# Altium schematic sheet 3d_dsn_approx.SchDoc
size A1; SheetNumber: 1; SheetTotal: 3
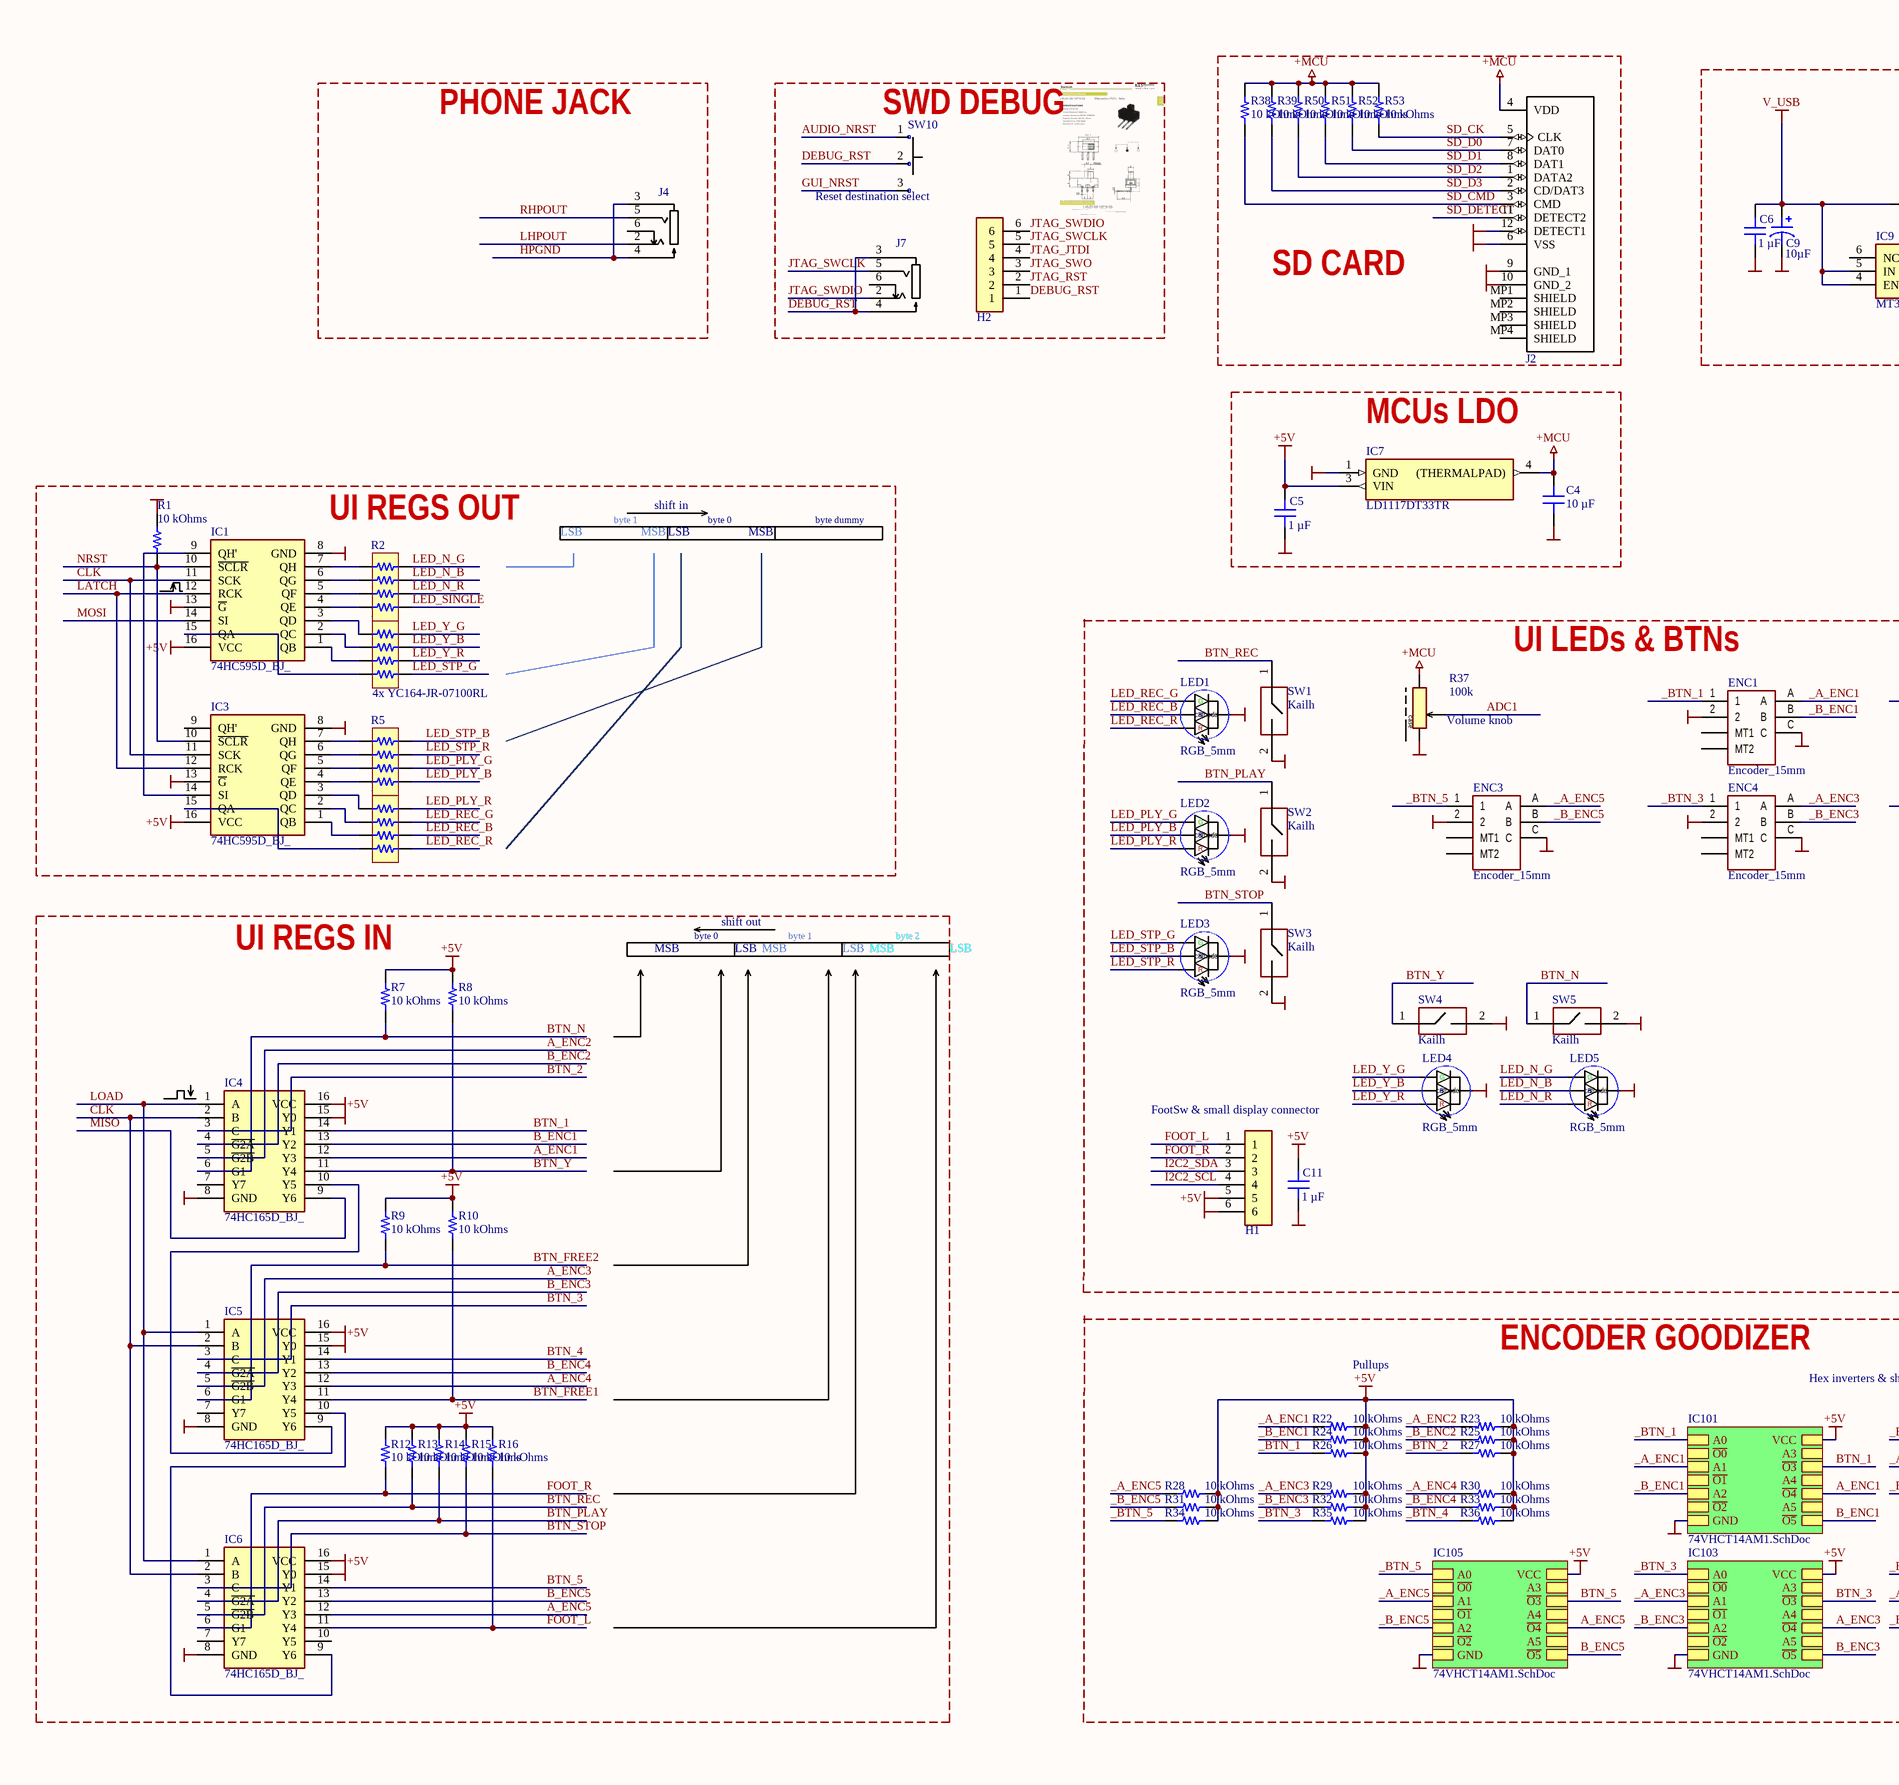
[diagram p0: 3d_dsn_approx.SchDoc, left]
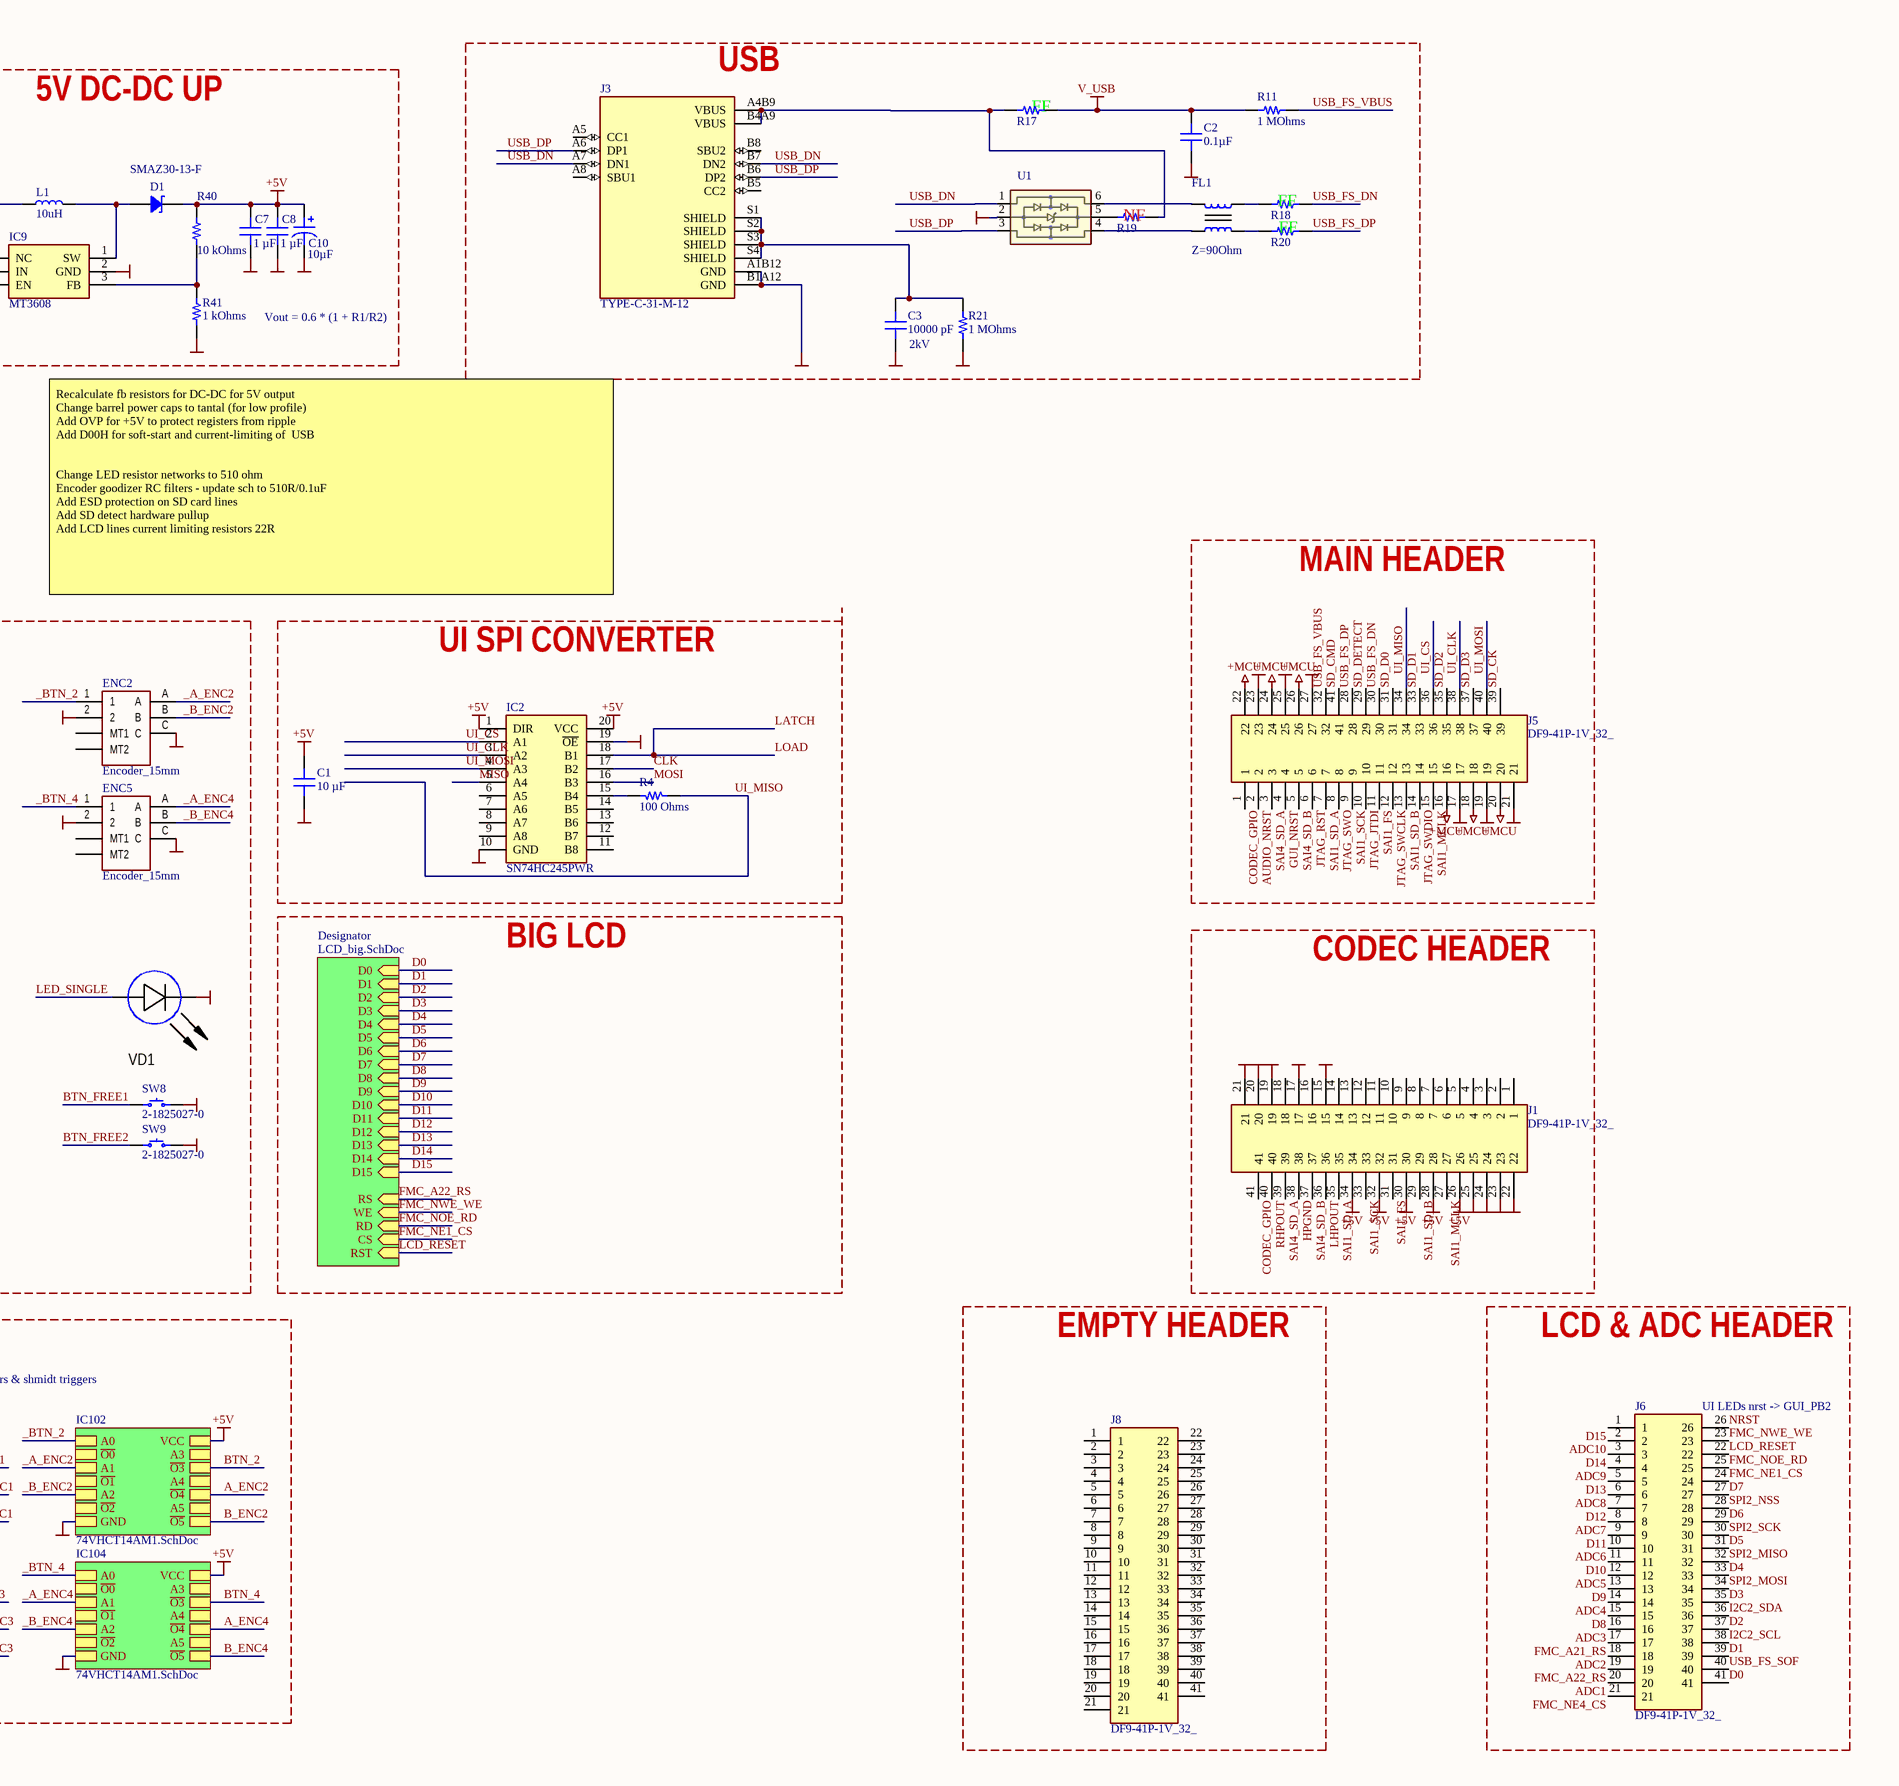
[diagram p1: 3d_dsn_approx.SchDoc, right]

## Parts
C1  10 µF  [CAP 0805_2012]
C2  0.1µF  [CAP 0402_1005]
C3  10000 pF  [CAP 1210_3225 - 1MM]
C4  10 µF  [CAP 0805_2012]
C5  1 µF  [CAP 0805_2012]
C6  1 µF  [CAP 0805_2012]
C7  1 µF  [CAP 0805_2012]
C8  1 µF  [CAP 0805_2012]
C9  10µF  [CAP ALSMD POLY 4.3MM H5.5MM]
C10  10µF  [CAP ALSMD POLY 4.3MM H5.5MM]
C11  1 µF  [CAP 0805_2012]
D1  SMAZ30-13-F  [DO214AC SMA]
ENC1  Encoder_15mm  [EC11_15mm]
ENC2  Encoder_15mm  [EC11_15mm]
ENC3  Encoder_15mm  [EC11_15mm]
ENC4  Encoder_15mm  [EC11_15mm]
ENC5  Encoder_15mm  [EC11_15mm]
FL1  Z=90Ohm  [FIL_ACM2012-361-2P-T002]
H1  1.5-6A  [1.5-6A]  (value not drawn)
H2  1.5-6A  [1.5-6A]  (value not drawn)
IC1  74HC595D_BJ_  [SOIC127P600X175-16N]
IC2  SN74HC245PWR  [SOP65P640X120-20N]
IC3  74HC595D_BJ_  [SOIC127P600X175-16N]
IC4  74HC165D_BJ_  [SOIC127P600X175-16N]
IC5  74HC165D_BJ_  [SOIC127P600X175-16N]
IC6  74HC165D_BJ_  [SOIC127P600X175-16N]
IC7  LD1117DT33TR  [TO228P972X240-3N]
IC9  MT3608  [SOT95P280X145-6N]
J1  DF9-41P-1V_32_  [HIROSE_DF9-41P-1V(32)]
J2  SCHA4B0400  [SCHA4B0400]  (value not drawn)
J3  TYPE-C-31-M-12  [HRO_TYPE-C-31-M-12 - REZONIT]
J4  35RASMT2BHNTRX  [PJ_327]  (value not drawn)
J5  DF9-41P-1V_32_  [HIROSE_DF9-41P-1V(32)]
J6  DF9-41P-1V_32_  [HIROSE_DF9-41P-1V(32)]
J7  35RASMT2BHNTRX  [PJ_327]  (value not drawn)
J8  DF9-41P-1V_32_  [HIROSE_DF9-41P-1V(32)]
L1  10uH  [IND_CD54]
LED1  RGB_5mm  [LED_RGB_5MM]
LED2  RGB_5mm  [LED_RGB_5MM]
LED3  RGB_5mm  [LED_RGB_5MM]
LED4  RGB_5mm  [LED_RGB_5MM]
LED5  RGB_5mm  [LED_RGB_5MM]
R1  10 kOhms  [RES 0603_1608]
R2  YC164-JR-07100RL  [RESNET 1206-8 CONVEX]  (value not drawn)
R3  YC164-JR-07100RL  [RESNET 1206-8 CONVEX]  (value not drawn)
R4  100 Ohms  [RES 0402_1005]
R5  YC164-JR-07100RL  [RESNET 1206-8 CONVEX]  (value not drawn)
R6  YC164-JR-07100RL  [RESNET 1206-8 CONVEX]  (value not drawn)
R7  10 kOhms  [RES 0603_1608]
R8  10 kOhms  [RES 0603_1608]
R9  10 kOhms  [RES 0603_1608]
R10  10 kOhms  [RES 0603_1608]
R11  1 MOhms  [RES 0603_1608]
R12  10 kOhms  [RES 0603_1608]
R13  10 kOhms  [RES 0603_1608]
R14  10 kOhms  [RES 0603_1608]
R15  10 kOhms  [RES 0603_1608]
R16  10 kOhms  [RES 0603_1608]
R17  (no value)  [RES 0603_1608]
R18  (no value)  [RES 0603_1608]
R19  (no value)  [RES 0603_1608]
R20  (no value)  [RES 0603_1608]
R21  1 MOhms  [RES 0603_1608]
R22  10 kOhms  [RES 0603_1608]
R23  10 kOhms  [RES 0603_1608]
R24  10 kOhms  [RES 0603_1608]
R25  10 kOhms  [RES 0603_1608]
R26  10 kOhms  [RES 0603_1608]
R27  10 kOhms  [RES 0603_1608]
R28  10 kOhms  [RES 0603_1608]
R29  10 kOhms  [RES 0603_1608]
R30  10 kOhms  [RES 0603_1608]
R31  10 kOhms  [RES 0603_1608]
R32  10 kOhms  [RES 0603_1608]
R33  10 kOhms  [RES 0603_1608]
R34  10 kOhms  [RES 0603_1608]
R35  10 kOhms  [RES 0603_1608]
R36  10 kOhms  [RES 0603_1608]
R37  100k  [POT]
R38  10 kOhms  [RES 0603_1608]
R39  10 kOhms  [RES 0603_1608]
R40  10 kOhms  [RES 0603_1608]
R41  1 kOhms  [RES 0603_1608]
R50  10 kOhms  [RES 0603_1608]
R51  10 kOhms  [RES 0603_1608]
R52  10 kOhms  [RES 0603_1608]
R53  10 kOhms  [RES 0603_1608]
SW1  Kailh  [Kailh_Low]
SW2  Kailh  [Kailh_Low]
SW3  Kailh  [Kailh_Low]
SW4  Kailh  [Kailh_Low]
SW5  Kailh  [Kailh_Low]
SW8  2-1825027-0  [TE 2-1825027-0]
SW9  2-1825027-0  [TE 2-1825027-0]
SW10  Reset destination select  [SLIDE_SW_BIG]
U1  (no value)  [SOT-666]
VD1  (no value)  [LED: 0805R]

## Blocks framed on the sheet
SD CARD: J2 R38 R39 R50-R53
5V DC-DC UP: C6-C10 D1 IC9 L1 R40 R41
USB: C2 C3 FL1 J3 R11 R17-R21 U1
PHONE JACK: J4
SWD DEBUG: H2 J7 SW10
MCUs LDO: C4 C5 IC7
UI REGS OUT: IC1 IC3 R1-R3 R5 R6
MAIN HEADER: J5
UI LEDs & BTNs: C11 ENC1-ENC5 H1 LED1-LED5 R37 SW1-SW5 SW8 SW9 VD1
UI REGS IN: IC4-IC6 R7-R10 R12-R16
CODEC HEADER: J1
ENCODER GOODIZER: R22-R36
EMPTY HEADER: J8
LCD & ADC HEADER: J6

## Sub-sheets
Designator = LCD_big.SchDoc: D8 (in), D6 (in), D0 (in), D14 (in), D2 (in), D11 (in), D9 (in), D13 (in), D3 (in), D1 (in), D4 (in), D15 (in), D10 (in), D5 (in), D7 (in), D12 (in), RS (in), RST (in), WE (in), RD (in), CS (in)
IC101 = 74VHCT14AM1.SchDoc: A0, ~{O0}, A1, ~{O1}, A2, ~{O2}, GND, VCC, A3, ~{O3}, A4, ~{O4}, A5, ~{O5}
IC102 = 74VHCT14AM1.SchDoc: A0, ~{O0}, A1, ~{O1}, A2, ~{O2}, GND, VCC, A3, ~{O3}, A4, ~{O4}, A5, ~{O5}
IC103 = 74VHCT14AM1.SchDoc: A0, ~{O0}, A1, ~{O1}, A2, ~{O2}, GND, VCC, A3, ~{O3}, A4, ~{O4}, A5, ~{O5}
IC104 = 74VHCT14AM1.SchDoc: A0, ~{O0}, A1, ~{O1}, A2, ~{O2}, GND, VCC, A3, ~{O3}, A4, ~{O4}, A5, ~{O5}
IC105 = 74VHCT14AM1.SchDoc: A0, ~{O0}, A1, ~{O1}, A2, ~{O2}, GND, VCC, A3, ~{O3}, A4, ~{O4}, A5, ~{O5}

## Nets
+5V: C1.2 C5.2 C7.2 C8.2 C10.1 C11.2 D1.2 H1.5 IC1.16(VCC) IC2.1(DIR) IC2.20(VCC) IC3.16(VCC) IC4.16(VCC) IC5.16(VCC) IC6.16(VCC) IC7.3(VIN) J1.26 J1.28 J1.30 J1.32 J1.34 R7.2 R8.2 R9.2 R10.2 R12.2 R13.2 R14.2 R15.2 R16.2 R22.2 R23.2 R24.2 R25.2 R26.2 R27.2 R28.2 R29.2 R30.2 R31.2 R32.2 R33.2 R34.2 R35.2 R36.2 R40.2 ; sheet IC101/VCC, sheet IC102/VCC, sheet IC103/VCC, sheet IC104/VCC, sheet IC105/VCC
+MCU: C4.2 IC7.4((THERMALPAD)) J2.4(VDD) J5.16 J5.18 J5.20 J5.22 J5.24 J5.26 R37.1 R38.2 R39.2 R50.2 R51.2 R52.2 R53.2
GND: C1.1 C2.1 C3.1 C4.1 C5.1 C6.1 C7.1 C8.1 C9.2 C10.2 C11.1 ENC1.2 ENC1.C ENC2.2 ENC2.C ENC3.2 ENC3.C ENC4.2 ENC4.C ENC5.2 ENC5.C H1.6 IC1.8(GND) IC1.13(~{G}) IC2.10(GND) IC2.19(~{OE}) IC3.8(GND) IC3.13(~{G}) IC4.8(GND) IC4.15(Y0) IC5.8(GND) IC5.15(Y0) IC6.8(GND) IC6.15(Y0) IC7.1(GND) IC9.2(GND) J1.15 J1.17 J1.19 J1.20 J1.21 J1.22 J1.23 J1.24 J1.25 J2.6(VSS) J2.9(GND_1) J2.10(GND_2) J2.12(DETECT1) J3.A1B12(GND) J3.B1A12(GND) J5.17 J5.19 J5.21 J5.23 J5.25 J5.27 LED1.3(cathode) LED2.3(cathode) LED3.3(cathode) LED4.3(cathode) LED5.3(cathode) R1.2 R21.1 R37.3 R41.1 SW1.2 SW2.2 SW3.2 SW4.2 SW5.2 SW8.2 SW9.2 U1.2 VD1.2(C) ; sheet IC101/GND, sheet IC102/GND, sheet IC103/GND, sheet IC104/GND, sheet IC105/GND
V_USB: C2.2 C6.2 C9.1 IC9.4(EN) IC9.5(IN) L1.2 R11.2 R17.1
_A_ENC1: ENC1.A R22.1 ; sheet IC101/A1
_A_ENC2: ENC2.A R23.1 ; sheet IC102/A1
_A_ENC3: ENC4.A R29.1 ; sheet IC103/A1
_A_ENC4: ENC5.A R30.1 ; sheet IC104/A1
_A_ENC5: ENC3.A R28.1 ; sheet IC105/A1
_B_ENC1: ENC1.B R24.1 ; sheet IC101/A2
_B_ENC2: ENC2.B R25.1 ; sheet IC102/A2
_B_ENC3: ENC4.B R32.1 ; sheet IC103/A2
_B_ENC4: ENC5.B R33.1 ; sheet IC104/A2
_B_ENC5: ENC3.B R31.1 ; sheet IC105/A2
_BTN_1: ENC1.1 R26.1 ; sheet IC101/A0
_BTN_2: ENC2.1 R27.1 ; sheet IC102/A0
_BTN_3: ENC4.1 R35.1 ; sheet IC103/A0
_BTN_4: ENC5.1 R36.1 ; sheet IC104/A0
_BTN_5: ENC3.1 R34.1 ; sheet IC105/A0
A_ENC1: IC4.12(Y3) ; sheet IC101/~{O4}
A_ENC2: IC4.5(~{G2B}) ; sheet IC102/~{O4}
A_ENC3: IC5.5(~{G2B}) ; sheet IC103/~{O4}
A_ENC4: IC5.12(Y3) ; sheet IC104/~{O4}
A_ENC5: IC6.12(Y3) ; sheet IC105/~{O4}
ADC1: J6.20 R37.2
ADC2: J6.18
ADC3: J6.16
ADC4: J6.14
ADC5: J6.12
ADC6: J6.10
ADC7: J6.8
ADC8: J6.6
ADC9: J6.4
ADC10: J6.2
AUDIO_NRST: J5.2 SW10.1
B_ENC1: IC4.13(Y2) ; sheet IC101/~{O5}
B_ENC2: IC4.4(~{G2A}) ; sheet IC102/~{O5}
B_ENC3: IC5.4(~{G2A}) ; sheet IC103/~{O5}
B_ENC4: IC5.13(Y2) ; sheet IC104/~{O5}
B_ENC5: IC6.13(Y2) ; sheet IC105/~{O5}
BTN_1: IC4.14(Y1) ; sheet IC101/~{O3}
BTN_2: IC4.3(C) ; sheet IC102/~{O3}
BTN_3: IC5.3(C) ; sheet IC103/~{O3}
BTN_4: IC5.14(Y1) ; sheet IC104/~{O3}
BTN_5: IC6.14(Y1) ; sheet IC105/~{O3}
BTN_FREE1: IC5.11(Y4) R10.1 SW8.1
BTN_FREE2: IC5.6(G1) R9.1 SW9.1
BTN_N: IC4.6(G1) R7.1 SW5.1
BTN_PLAY: IC6.4(~{G2A}) R14.1 SW2.1
BTN_REC: IC6.5(~{G2B}) R13.1 SW1.1
BTN_STOP: IC6.3(C) R15.1 SW3.1
BTN_Y: IC4.11(Y4) R8.1 SW4.1
CLK: IC1.11(SCK) IC2.17(B2) IC3.11(SCK) IC4.2(B) IC5.2(B) IC6.2(B)
CODEC_GPIO: J1.41 J5.1
D0: J6.41 ; sheet Designator/D0
D1: J6.39 ; sheet Designator/D1
D2: J6.37 ; sheet Designator/D2
D3: J6.35 ; sheet Designator/D3
D4: J6.33 ; sheet Designator/D4
D5: J6.31 ; sheet Designator/D5
D6: J6.29 ; sheet Designator/D6
D7: J6.27 ; sheet Designator/D7
D8: J6.15 ; sheet Designator/D8
D9: J6.13 ; sheet Designator/D9
D10: J6.11 ; sheet Designator/D10
D11: J6.9 ; sheet Designator/D11
D12: J6.7 ; sheet Designator/D12
D13: J6.5 ; sheet Designator/D13
D14: J6.3 ; sheet Designator/D14
D15: J6.1 ; sheet Designator/D15
DEBUG_RST: H2.1 J7.3 J7.4 SW10.2
FMC_A21_RS: J6.17
FMC_A22_RS: J6.19 ; sheet Designator/RS
FMC_NE1_CS: J6.24 ; sheet Designator/CS
FMC_NE4_CS: J6.21
FMC_NOE_RD: J6.25 ; sheet Designator/RD
FMC_NWE_WE: J6.23 ; sheet Designator/WE
FOOT_L: H1.1 IC6.11(Y4) R16.1
FOOT_R: H1.2 IC6.6(G1) R12.1
GUI_NRST: J5.4 SW10.3
HPGND: J1.38 J4.3 J4.4
I2C2_SCL: H1.4 J6.38
I2C2_SDA: H1.3 J6.36
JTAG_JTDI: H2.4 J5.10
JTAG_RST: H2.2 J5.6
JTAG_SWCLK: H2.5 J5.12 J7.5
JTAG_SWDIO: H2.6 J5.14 J7.2
JTAG_SWO: H2.3 J5.8
LATCH: IC1.12(RCK) IC2.18(B1) IC3.12(RCK) IC4.1(A) IC5.1(A) IC6.1(A)  [also labelled LOAD]
LCD_RESET: J6.22 ; sheet Designator/RST
LED_N_B: LED5.2(B) R2.3
LED_N_G: LED5.1(G) R2.4
LED_N_R: LED5.4(R) R2.2
LED_PLY_B: LED2.2(B) R5.1
LED_PLY_G: LED2.1(G) R5.2
LED_PLY_R: LED2.4(R) R6.4
LED_REC_B: LED1.2(B) R6.2
LED_REC_G: LED1.1(G) R6.3
LED_REC_R: LED1.4(R) R6.1
LED_SINGLE: R2.1 VD1.1(A)
LED_STP_B: LED3.2(B) R5.4
LED_STP_G: LED3.1(G) R3.1
LED_STP_R: LED3.4(R) R5.3
LED_Y_B: LED4.2(B) R3.3
LED_Y_G: LED4.1(G) R3.4
LED_Y_R: LED4.4(R) R3.2
LHPOUT: J1.36 J4.2
MISO: IC2.5(A4) IC4.9(Y6)
MOSI: IC1.14(SI) IC2.16(B3)
NRST: IC1.10(~{SCLR}) IC3.10(~{SCLR}) J6.26 R1.1
RHPOUT: J1.40 J4.5
SAI1_FS: J1.31 J5.11
SAI1_MCLK: J1.27 J5.15
SAI1_SCK: J1.33 J5.9
SAI1_SD_A: J1.35 J5.7
SAI1_SD_B: J1.29 J5.13
SAI4_SD_A: J1.39 J5.3
SAI4_SD_B: J1.37 J5.5
SD_CK: J2.5(CLK) J5.39 R53.1
SD_CMD: J2.3(CMD) J5.41 R38.1
SD_D0: J2.7(DAT0) J5.31 R52.1
SD_D1: J2.8(DAT1) J5.33 R51.1
SD_D2: J2.1(DATA2) J5.35 R50.1
SD_D3: J2.2(CD/DAT3) J5.37 R39.1
SD_DETECT: J2.11(DETECT2) J5.29
SPI2_MISO: J6.32
SPI2_MOSI: J6.34
SPI2_NSS: J6.28
SPI2_SCK: J6.30
UI_CLK: IC2.3(A2) J5.38
UI_CS: IC2.2(A1) J5.36
UI_MISO: J5.34 R4.1
UI_MOSI: IC2.4(A3) J5.40
USB_DN: J3.A7(DN1) J3.B7(DN2) U1.1
USB_DP: J3.A6(DP1) J3.B6(DP2) U1.3
USB_FS_DN: J5.30 R18.1
USB_FS_DP: J5.28 R20.1
USB_FS_SOF: J6.40
USB_FS_VBUS: J5.32 R11.1
NetC3_2: C3.2 J3.S1(SHIELD) J3.S2(SHIELD) J3.S3(SHIELD) J3.S4(SHIELD) R21.2
NetD1_1: D1.1 IC9.1(SW) L1.1
NetFL1_1: FL1.1 U1.6
NetFL1_2: FL1.2 U1.4
NetFL1_3: FL1.3 R20.2
NetFL1_4: FL1.4 R18.2
NetIC1_1: IC1.1(QB) R3.7
NetIC1_2: IC1.2(QC) R3.6
NetIC1_3: IC1.3(QD) R3.5
NetIC1_4: IC1.4(QE) R2.8
NetIC1_5: IC1.5(QF) R2.7
NetIC1_6: IC1.6(QG) R2.6
NetIC1_7: IC1.7(QH) R2.5
NetIC1_9: IC1.9(QH') IC3.14(SI)
NetIC1_15: IC1.15(QA) R3.8
NetIC2_15: IC2.15(B4) R4.2
NetIC3_1: IC3.1(QB) R6.7
NetIC3_2: IC3.2(QC) R6.6
NetIC3_3: IC3.3(QD) R6.5
NetIC3_4: IC3.4(QE) R5.8
NetIC3_5: IC3.5(QF) R5.7
NetIC3_6: IC3.6(QG) R5.6
NetIC3_7: IC3.7(QH) R5.5
NetIC3_15: IC3.15(QA) R6.8
NetIC4_10: IC4.10(Y5) IC5.9(Y6)
NetIC5_10: IC5.10(Y5) IC6.9(Y6)
NetIC9_3: IC9.3(FB) R40.1 R41.2
NetJ3_A4B9: J3.A4B9(VBUS) J3.B4A9(VBUS) R17.2 R19.1
NetR19_2: R19.2 U1.5

Not connected (* = marked no-connect by the designer): ENC1 MT1 MT2; ENC2 MT1 MT2; ENC3 MT1 MT2; ENC4 MT1 MT2; ENC5 MT1 MT2; IC2 6(A5) 7(A6) 8(A7) 9(A8) 11(B8) 12(B7) 13(B6) 14(B5); IC3 9(QH'); IC4 7(Y7); IC5 7(Y7); IC6 7(Y7) 10(Y5); IC9 6(NC); J1 1 2 3 4 5 6 7 8 9 10 11 12 13 14 16 18; J2 MP1(SHIELD) MP2(SHIELD) MP3(SHIELD) MP4(SHIELD); J3 A5(CC1) A8(SBU1) B5(CC2) B8(SBU2); J4 6(4); J7 6(4); J8 1 2 3 4 5 6 7 8 9 10 11 12 13 14 15 16 17 18 19 20 21 22 23 24 25 26 27 28 29 30 31 32 33 34 35 36 37 38 39 40 41; R37 4

## Notes on the sheet
- (near R17) FF
- (near R19) NF
- (near R18) FF
- (near R20) FF
- Vout = 0.6 * (1 + R1/R2)
- (near C3) 2kV
- shift in
- LSB
- byte 1
- MSB
- byte 0
- byte dummy
- Recalculate fb resistors for DC-DC for 5V output
  Change barrel power caps to tantal (for low profile)
  Add OVP for +5V to protect registers from ripple
  Add D00H for soft-start and current-limiting of  USB
  Change LED resistor networks to 510 ohm
  Encoder goodizer RC filters - update sch to 510R/0.1uF
  Add ESD protection on SD card lines
  Add SD detect hardware pullup
  Add LCD lines current limiting resistors 22R
- (near R3) 4x YC164-JR-07100RL
- UI SPI CONVERTER
- (near R37) Volume knob
- shift out
- byte 2
- BIG LCD
- (near H1) FootSw & small display connector
- Pullups
- Hex inverters & shmidt triggers
- (near J6) UI LEDs nrst -> GUI_PB2
- (in symbol POT 9MM 100K) case

## Library data of the parts
C1 C4 = C0805C106K8PAC7800: CAP CER 10UF 10V X5R 0805; manufacturer: KEMET; Tolerance: ±10%; Part Number: C0805C106K8PAC7800; Value: 10 µF; Applications: Bypass, Decoupling; Capacitance: 10 µF; componentlink1description: Datasheet; componentlink1url: https://connect.kemet.com:7667/gateway/IntelliData-ComponentDocumentation/1.0/download/datasheet/C0805C106K8PACTU; componentlink2description: DigiKey Link; componentlink2url: https://www.digikey.com/en/products/detail/kemet/C0805C106K8PAC7800/1090830; Device Package: 0805 (2012 Metric); lastupdated: 9/14/2022 7:51:56 AM; Lifecycle Status: Active; Minimum Order: 1; Mounting Type: Surface Mount, MLCC; Operating Temperature: -55°C ~ 85°C; Package / Case: 0805 (2012 Metric); packaging: TapeAndReel; partid: 44790; Part Status: Active; price: 0.02; series: SMD Comm X5R; Size / Dimension: 0.079" L x 0.049" W (2.00mm x 1.25mm); Supplier 1: DigiKey; Supplier Part Number 1: 399-C0805C106K8PAC7800CT-ND; Temperature Coefficient: X5R; Thickness (Max): 0.055" (1.40mm); Voltage - Rated: 10V
C2 = C0402C104K4RACAUTO: CAP CER 0.1UF 16V X7R 0402; Manufacturer: KEMET; Tolerance: ±10%; Part Number: C0402C104K4RACAUTO; Value: 0.1µF; Applications: Automotive, Bypass, Decoupling; Capacitance: 0.1µF; ComponentLink1Description: Datasheet; ComponentLink1URL: https://api.kemet.com/component-edge/download/specsheet/C0402C104K4RACAUTO.pdf; ComponentLink2Description: DigiKey Link; ComponentLink2URL: http://digikey.com/product-detail/en/kemet/C0402C104K4RACAUTO/399-6828-1-ND/3314343; Device Package: 0402 (1005 Metric); LastUpdated: 9/2/2020 1:02:21 AM; Lifecycle Status: Active; Minimum Order: 1; Mounting Type: Surface Mount, MLCC; Operating Temperature: -55°C ~ 125°C; Package / Case: 0402 (1005 Metric); Packaging: TapeAndReel; PartId: 3024; Part Status: Active; Price: 0.01; Ratings: AEC-Q200; Series: SMD Auto X7R; Size / Dimension: 0.039" L x 0.020" W (1.00mm x 0.50mm); Supplier 1: DigiKey; Supplier Part Number 1: 399-6828-1-ND; Temperature Coefficient: X7R; Thickness (Max): 0.022" (0.55mm); Voltage - Rated: 16V
C3 = C1210C103KDRAC7800: CAP CER 10000PF 1KV X7R 1210; manufacturer: KEMET; Tolerance: ±10%; Voltage - Rated: 1000V (1kV); Part Number: C1210C103KDRAC7800; Value: 10000 pF; Applications: General Purpose; Capacitance: 10000 pF; componentlink1description: Datasheet; componentlink1url: https://api.kemet.com/component-edge/download/datasheet/C1210C103KDRACTU.pdf; componentlink2description: DigiKey Link; componentlink2url: https://www.digikey.com/en/products/detail/kemet/C1210C103KDRAC7800/2216434; Device Package: 1210 (3225 Metric); Features: Low ESL, High Voltage; lastupdated: 9/16/2023 7:34:43 PM; Lifecycle Status: Active; Minimum Order: 1; Mounting Type: Surface Mount, MLCC; Operating Temperature: -55°C ~ 125°C; Package / Case: 1210 (3225 Metric); packaging: TapeAndReel; partid: 29443; Part Status: Active; price: 0.09; series: SMD Comm X7R HV; Size / Dimension: 0.126" L x 0.098" W (3.20mm x 2.50mm); Supplier 1: DigiKey; Supplier Part Number 1: 399-C1210C103KDRAC7800CT-ND; Temperature Coefficient: X7R; Thickness (Max): 0.061" (1.55mm)
C5-C8 C11 = C0805C105K4RAC7800: CAP CER 1UF 16V X7R 0805; manufacturer: KEMET; Tolerance: ±10%; Part Number: C0805C105K4RAC7800; Value: 1 µF; Applications: Bypass, Decoupling; Capacitance: 1 µF; componentlink1description: Datasheet; componentlink1url: https://api.kemet.com/component-edge/download/datasheet/C0805C105K4RACTU.pdf; componentlink2description: DigiKey Link; componentlink2url: https://www.digikey.com/en/products/detail/kemet/C0805C105K4RAC7800/416047; Device Package: 0805 (2012 Metric); lastupdated: 9/19/2022 1:03:30 PM; Lifecycle Status: Active; Minimum Order: 1; Mounting Type: Surface Mount, MLCC; Operating Temperature: -55°C ~ 125°C; Package / Case: 0805 (2012 Metric); packaging: TapeAndReel; partid: 32075; Part Status: Active; price: 0.01; series: SMD Comm X7R; Size / Dimension: 0.079" L x 0.049" W (2.00mm x 1.25mm); Supplier 1: DigiKey; Supplier Part Number 1: 399-C0805C105K4RAC7800CT-ND; Temperature Coefficient: X7R; Thickness (Max): 0.039" (1.00mm); Voltage - Rated: 16V
C9 C10 = EEE-1VA100WR: CAP ALUM 10UF 20% 35V SMD; Manufacturer: Panasonic Electronic Components; Lifetime @ Temp.: 1000 Hrs @ 85°C; Polarization: Polar; Ripple Current @ High Frequency: 37.4mA @ 10kHz; Ripple Current @ Low Frequency: 22mA @ 120Hz; Surface Mount Land Size: 0.169" L x 0.169" W (4.30mm x 4.30mm); Part Number: EEE-1VA100WR; Applications: Automotive; Capacitance: 10µF; ComponentLink1Description: Datasheet; ComponentLink1URL: //media.digikey.com/pdf/Data%20Sheets/Panasonic%20Electronic%20Components/S_Series,Type_V_Rev2018.pdf; ComponentLink2Description: DigiKey Link; ComponentLink2URL: http://digikey.com/product-detail/en/panasonic-electronic-components/EEE-1VA100WR/PCE3948CT-ND/766324; Device Package: Radial, Can - SMD; Height - Seated (Max): 0.213" (5.40mm); LastUpdated: 9/2/2020 1:23:46 AM; Lifecycle Status: Active; Minimum Order: 1; Mounting Type: Surface Mount; Operating Temperature: -40°C ~ 85°C; Package / Case: Radial, Can - SMD; Packaging: TapeAndReel; PartId: 7033; Part Status: Active; Price: 0.07; Ratings: AEC-Q200; Series: S; Size / Dimension: 0.157" Dia (4.00mm); Supplier 1: DigiKey; Supplier Part Number 1: PCE3948CT-ND; Tolerance: ±20%; Value: 10µF; Voltage - Rated: 35V
D1 = SMAZ30-13-F: DIODE ZENER 30V 1W SMA; Manufacturer: Diodes Incorporated; Current - Reverse Leakage @ Vr: 500nA @ 22.8V; Impedance (Max) (Zzt): 15 Ohms; Tolerance: ±5%; Voltage - Forward (Vf) (Max) @ If: 1.2V @ 200mA; Part Number: SMAZ30-13-F; ComponentLink1Description: Datasheet; ComponentLink1URL: https://www.diodes.com/assets/Datasheets/ds18015.pdf; ComponentLink2Description: DigiKey Link; ComponentLink2URL: http://digikey.com/product-detail/en/diodes-incorporated/SMAZ30-13-F/SMAZ30-FDICT-ND/755499; LastUpdated: 9/2/2020 1:19:18 AM; Lifecycle Status: Active; Minimum Order: 1; Mounting Type: Surface Mount; Operating Temperature: -65°C ~ 150°C; Package / Case: DO-214AC, SMA; Packaging: TapeAndReel; PartId: 1520; Part Status: Active; Power - Max: 1W; Price: 0.10; Series: -; Supplier 1: DigiKey; Supplier Part Number 1: SMAZ30-FDICT-ND; Supplier Device Package: SMA; Voltage - Zener (Nom) (Vz): 30V
FL1 = ACM2012-361-2P-T002: ACM Series 0805 360 Ohm 220mA 500 mOhm DCR 50 V SMT Common Mode Filter; MF: TDK; MP: ACM2012-361-2P-T002; Price: 0.24 USD; Package: None; Availability: Good; Value: *
H1 H2 = 1.5-6A: Pin Header p=1.5mm, 6 pins
IC1 IC3 = 74HC595D_BJ_: Integrated Circuit; Manufacturer_Name: Toshiba; Manufacturer_Part_Number: 74HC595D(BJ); Datasheet Link: https://componentsearchengine.com/Datasheets/1/74HC595D(BJ).pdf; Height: 1.75mm; Mouser Part Number: 757-74HC595DBJ; Mouser Price/Stock: https://www.mouser.co.uk/ProductDetail/Toshiba/74HC595DBJ?qs=T%2FywbITssnTkqd02WdSNRg%3D%3D; Arrow Part Number: 74HC595D(BJ); Arrow Price/Stock: https://www.arrow.com/en/products/74hc595d-bj/toshiba?region=nac
IC2 = SN74HC245PWR: Integrated Circuit; Manufacturer_Name: Texas Instruments; Datasheet Link: http://www.ti.com/lit/gpn/sn74hc245; Height: 1.2mm; Manufacturer_Part_Number: SN74HC245PWR; Mouser Part Number: 595-SN74HC245PWR; Mouser Price/Stock: https://www.mouser.co.uk/ProductDetail/Texas-Instruments/SN74HC245PWR?qs=JS6RUWRH9DXHcWNikQOotA%3D%3D; Arrow Part Number: SN74HC245PWR; Arrow Price/Stock: https://www.arrow.com/en/products/sn74hc245pwr/texas-instruments?region=nac
IC4-IC6 = 74HC165D_BJ_: Integrated Circuit; Manufacturer_Name: Toshiba; Manufacturer_Part_Number: 74HC165D(BJ); Datasheet Link: https://www.arrow.com/en/products/74hc165d-bj/toshiba?region=nac; Height: 1.75mm; Mouser Part Number: 757-74HC165DBJ; Mouser Price/Stock: https://www.mouser.co.uk/ProductDetail/Toshiba/74HC165DBJ?qs=lQAVKuKFhkJom8fGze1o7Q%3D%3D; Arrow Part Number: 74HC165D(BJ); Arrow Price/Stock: https://www.arrow.com/en/products/74hc165d-bj/toshiba?region=nac
IC7 = LD1117DT33TR: Integrated Circuit; Manufacturer_Name: STMicroelectronics; Datasheet Link: http://www.st.com/web/en/resource/technical/document/datasheet/CD00000544.pdf; Height: 2.4mm; Manufacturer_Part_Number: LD1117DT33TR; Mouser Part Number: 511-LD1117DT33-TR; Mouser Price/Stock: https://www.mouser.co.uk/ProductDetail/STMicroelectronics/LD1117DT33TR?qs=4JhUBQGAOSd4P5jVYGxp2g%3D%3D; Arrow Part Number: LD1117DT33TR; Arrow Price/Stock: https://www.arrow.com/en/products/ld1117dt33tr/stmicroelectronics?region=nac
IC9 = MT3608: Integrated Circuit; Manufacturer_Name: Aerosemi; Datasheet Link: https://www.olimex.com/Products/Breadboarding/BB-PWR-3608/resources/MT3608.pdf; Height: 1.45mm; Manufacturer_Part_Number: MT3608
J1 J5 J6 J8 = DF9-41P-1V_32_: Connector; Manufacturer_Name: Hirose; Manufacturer_Part_Number: DF9-41P-1V(32); Datasheet Link: http://componentsearchengine.com/Datasheets/1/DF9-41P-1V(32).pdf; Mouser Part Number: 798-DF9-41P-1V32; Mouser Price/Stock: https://www.mouser.co.uk/ProductDetail/Hirose-Connector/DF9-41P-1V32?qs=zOgoZG1CgI%252BzVCgniEkwOw%3D%3D; Arrow Part Number: DF9-41P-1V(32); Arrow Price/Stock: https://www.arrow.com/en/products/df9-41p-1v-32/hirose-electric
J2 = SCHA4B0400: SD card Connector; Manufacturer_Name: ALPS Electric; Datasheet Link: https://br.mouser.com/datasheet/2/15/SCHA-1155938.pdf; Height: 1.29mm; Manufacturer_Part_Number: SCHA4B0400; Mouser Part Number: 688-SCHA4B0400; Mouser Price/Stock: https://www.mouser.com/Search/Refine.aspx?Keyword=688-SCHA4B0400
J3 = TYPE-C-31-M-12: USB Connectors 24 Receptacle 1 8.94*7.3mm RoHS; MF: {'manufacturer': u'HRO Electronics Co., Ltd.'}; Package: None; Price: None; Value: *; MP: TYPE-C-31-M-12; Availability: Unavailable
J4 J7 = 3.5mm jack stereo smd: Conn 3.5MM Stereo Jack F 3 POS Solder RA SMD 3 Terminal 1 Port T/R; MF: Switchcraft; MP: 35RASMT2BHNTRX; Package: None; Price: 0.84 USD; Availability: Good; SnapEDA_Link: https://www.snapeda.com/parts/35RASMT2BHNTRX/Switchcraft%20Inc./view-part/?ref=snap; Value: *
L1 = Inductor_CD54: Aliexpress CD54 type inductor
LED1-LED5 = RGB_CC_5mm
R1 R7-R10 R12-R16 R22-R36 R38-R40 R50-R53 = RT0603FRE0710KL: RES SMD 10K OHM 1% 1/10W 0603; Manufacturer: Yageo; Power (Watts): 0.1W, 1/10W; Temperature Coefficient: ±50ppm/°C; Part Number: RT0603FRE0710KL; Value: 10 kOhms; ComponentLink1Description: Datasheet; ComponentLink1URL: https://www.yageo.com/upload/media/product/productsearch/datasheet/rchip/PYu-RT_1-to-0.01_RoHS_L_11.pdf; ComponentLink2Description: DigiKey Link; ComponentLink2URL: http://digikey.com/product-detail/en/yageo/RT0603FRE0710KL/YAG2321CT-ND/5252435; Composition: Thin Film; Device Package: 0603 (1608 Metric); Height - Seated (Max): 0.022" (0.55mm); LastUpdated: 9/2/2020 1:10:23 AM; Lifecycle Status: Active; Minimum Order: 1; Number of Terminations: 2; Operating Temperature: -55°C ~ 155°C; Package / Case: 0603 (1608 Metric); Packaging: TapeAndReel; PartId: 5671; Part Status: Active; Price: 0.01; Resistance: 10 kOhms; Series: RT; Size / Dimension: 0.063" L x 0.031" W (1.60mm x 0.80mm); Supplier 1: DigiKey; Supplier Part Number 1: YAG2321CT-ND; Supplier Device Package: 0603; Tolerance: ±1%
R2 R3 R5 R6 = YC164-JR-07100RL: RES ARRAY 4 RES 100 OHM 1206; Manufacturer: Yageo; Circuit Type: Isolated; Number of Resistors: 4; Power Per Element: 62.5mW; Resistance (Ohms): 100; Temperature Coefficient: ±200ppm/°C; Tolerance: ±5%; Part Number: YC164-JR-07100RL; Applications: DDRAM, SDRAM; ComponentLink1Description: Datasheet; ComponentLink1URL: https://www.yageo.com/upload/media/product/productsearch/datasheet/rchip/PYu-YC_TC_group_51_RoHS_L_9.pdf; ComponentLink2Description: DigiKey Link; ComponentLink2URL: http://digikey.com/product-detail/en/yageo/YC164-JR-07100RL/YC164J-100CT-ND/1005656; Height - Seated (Max): 0.028" (0.70mm); LastUpdated: 9/2/2020 1:23:24 AM; Lifecycle Status: Active; Minimum Order: 1; Mounting Type: Surface Mount; Number of Pins: 8; Operating Temperature: -55°C ~ 155°C; Package / Case: 1206 (3216 Metric), Convex, Long Side Terminals; Packaging: TapeAndReel; PartId: 239; Part Status: Active; Price: 0.01; Series: YC164; Size / Dimension: 0.126" L x 0.063" W (3.20mm x 1.60mm); Supplier 1: DigiKey; Supplier Part Number 1: YC164J-100CT-ND
R4 = RT0402FRE07100RL: RES SMD 100 OHM 1% 1/16W 0402; Manufacturer: Yageo; Power (Watts): 0.063W, 1/16W; Temperature Coefficient: ±50ppm/°C; Part Number: RT0402FRE07100RL; Value: 100 Ohms; ComponentLink1Description: Datasheet; ComponentLink1URL: https://www.yageo.com/upload/media/product/productsearch/datasheet/rchip/PYu-RT_1-to-0.01_RoHS_L_11.pdf; ComponentLink2Description: DigiKey Link; ComponentLink2URL: http://digikey.com/product-detail/en/yageo/RT0402FRE07100RL/YAG3342CT-ND/5418047; Composition: Thin Film; Device Package: 0402 (1005 Metric); Height - Seated (Max): 0.014" (0.35mm); LastUpdated: 9/2/2020 1:08:09 AM; Lifecycle Status: Active; Minimum Order: 1; Number of Terminations: 2; Operating Temperature: -55°C ~ 155°C; Package / Case: 0402 (1005 Metric); Packaging: TapeAndReel; PartId: 3193; Part Status: Active; Price: 0.01; Resistance: 100 Ohms; Series: RT; Size / Dimension: 0.039" L x 0.020" W (1.00mm x 0.50mm); Supplier 1: DigiKey; Supplier Part Number 1: YAG3342CT-ND; Supplier Device Package: 0402; Tolerance: ±1%
R11 R21 = RT0603FRE071ML: RES SMD 1M OHM 1% 1/10W 0603; Manufacturer: Yageo; Power (Watts): 0.1W, 1/10W; Temperature Coefficient: ±50ppm/°C; Part Number: RT0603FRE071ML; Value: 1 MOhms; ComponentLink1Description: Datasheet; ComponentLink1URL: https://www.yageo.com/upload/media/product/productsearch/datasheet/rchip/PYu-RT_1-to-0.01_RoHS_L_11.pdf; ComponentLink2Description: DigiKey Link; ComponentLink2URL: http://digikey.com/product-detail/en/yageo/RT0603FRE071ML/YAG5944CT-ND/9370974; Composition: Thin Film; Device Package: 0603 (1608 Metric); Height - Seated (Max): 0.022" (0.55mm); LastUpdated: 9/2/2020 1:10:14 AM; Lifecycle Status: Active; Minimum Order: 1; Number of Terminations: 2; Operating Temperature: -55°C ~ 155°C; Package / Case: 0603 (1608 Metric); Packaging: TapeAndReel; PartId: 10191; Part Status: Active; Price: 0.01; Resistance: 1 MOhms; Series: RT; Size / Dimension: 0.063" L x 0.031" W (1.60mm x 0.80mm); Supplier 1: DigiKey; Supplier Part Number 1: YAG5944CT-ND; Supplier Device Package: 0603; Tolerance: ±1%
R17-R20 = RCA06030000ZSEA: RES SMD 0 OHM JUMPER 1/10W 0603; Manufacturer: Vishay Dale; Power (Watts): 0.1W, 1/10W; Part Number: RCA06030000ZSEA; ComponentLink1Description: Datasheet; ComponentLink1URL: http://www.vishay.com/docs/20037/rcae3.pdf; ComponentLink2Description: DigiKey Link; ComponentLink2URL: http://digikey.com/product-detail/en/vishay-dale/RCA06030000ZSEA/541-2192-1-ND/4946845; Composition: Thick Film; Device Package: 0603 (1608 Metric); Features: Anti-Sulfur, Automotive AEC-Q200; Height - Seated (Max): 0.020" (0.50mm); LastUpdated: 9/2/2020 1:10:23 AM; Lifecycle Status: Active; Minimum Order: 1; Number of Terminations: 2; Operating Temperature: -55°C ~ 155°C; Package / Case: 0603 (1608 Metric); Packaging: TapeAndReel; PartId: 5740; Part Status: Active; Price: 0.01; Ratings: AEC-Q200; Series: RCA; Size / Dimension: 0.061" L x 0.033" W (1.55mm x 0.85mm); Supplier 1: DigiKey; Supplier Part Number 1: 541-2192-1-ND; Supplier Device Package: 0603; Tolerance: Jumper
R37 = POT 9MM 100K
R41 = RT0603FRE071KL: RES SMD 1K OHM 1% 1/10W 0603; Manufacturer: Yageo; Power (Watts): 0.1W, 1/10W; Temperature Coefficient: ±50ppm/°C; Part Number: RT0603FRE071KL; Value: 1 kOhms; ComponentLink1Description: Datasheet; ComponentLink1URL: https://www.yageo.com/upload/media/product/productsearch/datasheet/rchip/PYu-RT_1-to-0.01_RoHS_L_11.pdf; ComponentLink2Description: DigiKey Link; ComponentLink2URL: https://www.digikey.com/en/products/detail/yageo/RT0603FRE071KL/1075188; Composition: Thin Film; Device Package: 0603 (1608 Metric); Height - Seated (Max): 0.022" (0.55mm); LastUpdated: 9/19/2022 1:22:31 PM; Lifecycle Status: Active; Minimum Order: 1; Number of Terminations: 2; Operating Temperature: -55°C ~ 155°C; Package / Case: 0603 (1608 Metric); Packaging: TapeAndReel; PartId: 5672; Part Status: Active; Price: 0.01; Resistance: 1 kOhms; Series: RT; Size / Dimension: 0.063" L x 0.031" W (1.60mm x 0.80mm); Supplier 1: DigiKey; Supplier Part Number 1: YAG2323CT-ND; Supplier Device Package: 0603; Tolerance: ±1%
SW1-SW5 = Kailh_SW: Kailh keyboard switch
SW8 SW9 = 2-1825027-0: SWITCH TACTILE SPST-NO 0.05A 24V; Manufacturer: TE Connectivity ALCOSWITCH Switches; Actuator Length, Right Angle: 11.85mm; Actuator Orientation: Side Actuated; Actuator Type: Standard; Contact Rating @ Voltage: 0.05A @ 24VDC; Illumination: Non-Illuminated; Operating Force: 160gf; Outline: 7.11mm x 6.60mm; Switch Function: Off-Mom; Part Number: 2-1825027-0; Circuit: SPST-NO; ComponentLink1Description: Datasheet; ComponentLink1URL: https://www.te.com/commerce/DocumentDelivery/DDEController?Action=srchrtrv&DocNm=1308111-1_SWITCHES_CORE_PROGRAM_CATALOG&DocType=CS&DocLang=English; ComponentLink2Description: DigiKey Link; ComponentLink2URL: http://digikey.com/product-detail/en/te-connectivity-alcoswitch-switches/2-1825027-0/450-1661-ND/1632547; LastUpdated: 9/6/2020 11:08:27 AM; Lifecycle Status: Active; Minimum Order: 1; Mounting Type: Through Hole, Right Angle; Operating Temperature: -35°C ~ 85°C; Packaging: Bulk; Part Status: Active; Price: 0.22; Series: FSMRAJ; Supplier 1: DigiKey; Supplier Part Number 1: 450-1661-ND; Termination Style: PC Pin
SW10 = RockerSwitch_3mm: Slide switch
U1 = USBLC6-2: Very Low Capacitance Esd Protection; MF: STMicroelectronics; Availability: Unavailable; Price: None; Package: SOT-563 STMicroelectronics; MP: USBLC6-2; Value: *; helpurl: https://lib.chipdip.ru/093/DOC001093117.pdf
VD1 = LED_single: ValueManufacturerPartNumber: LED, Green, *, *, *, -55...+150°C; TypeDiode: LED; ColorParameter: Green; Manufacturer: *; Package: *; HelpURL: *; Temperature: -55...+150°C; Current: *; VoltageDrop: *; PartNumber: *; Color: GREEN; Supplier 1: LCSC; Supplier Part Number 1: C919445